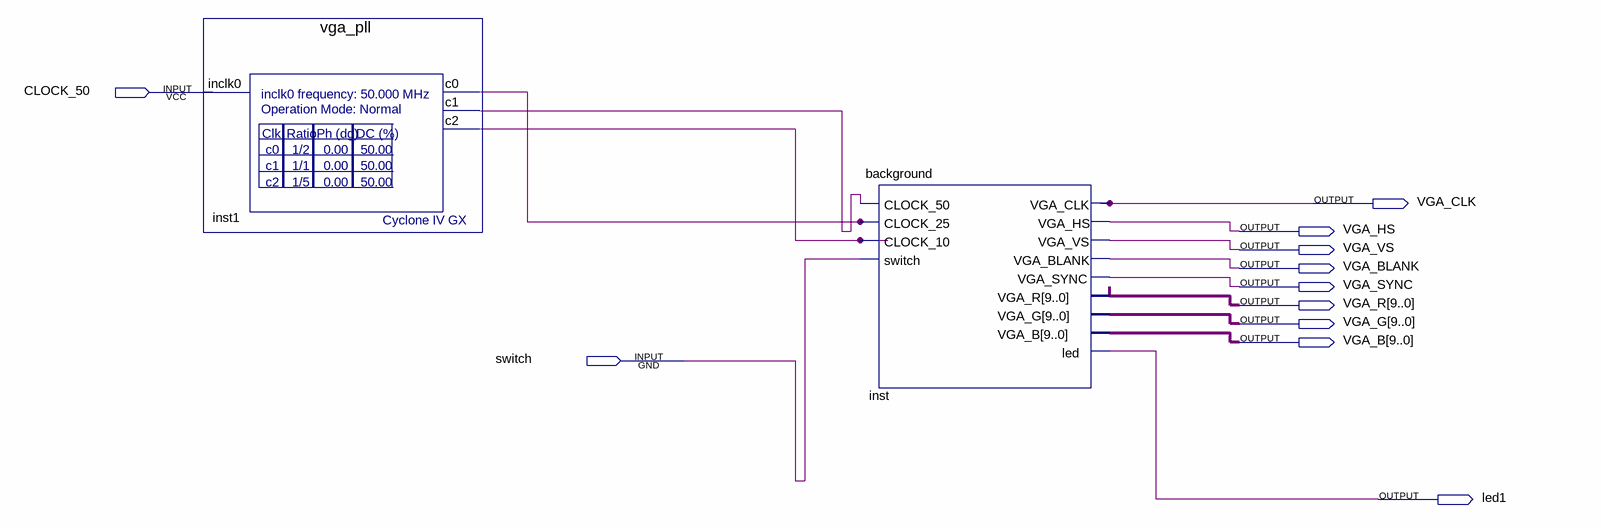
[diagram p0: schematic sheet]
// Quartus schematic ControladorVGA.bdf as structural Verilog: 2 symbols, 11 pins
module ControladorVGA (
  input  CLOCK_50,
  input  switch,
  output VGA_CLK,
  output VGA_HS,
  output VGA_VS,
  output VGA_BLANK,
  output VGA_SYNC,
  output [9:0] VGA_R,
  output [9:0] VGA_G,
  output [9:0] VGA_B,
  output led1
);

  wire inst1_c0, inst1_c1, inst1_c2;

  vga_pll inst1 (.inclk0(CLOCK_50), .c0(inst1_c0), .c1(inst1_c1), .c2(inst1_c2));
  background inst (
    .CLOCK_50(inst1_c1), .CLOCK_25(inst1_c0), .CLOCK_10(inst1_c2), .switch(switch), .VGA_CLK(VGA_CLK),
    .VGA_HS(VGA_HS), .VGA_VS(VGA_VS), .VGA_BLANK(VGA_BLANK), .VGA_SYNC(VGA_SYNC), .VGA_R(VGA_R),
    .VGA_G(VGA_G), .VGA_B(VGA_B), .led(led1));
endmodule
